# Altium schematic sheet Sitara_IO_Bank_123.SchDoc
size A3; SheetNumber: 7; SheetTotal: 10
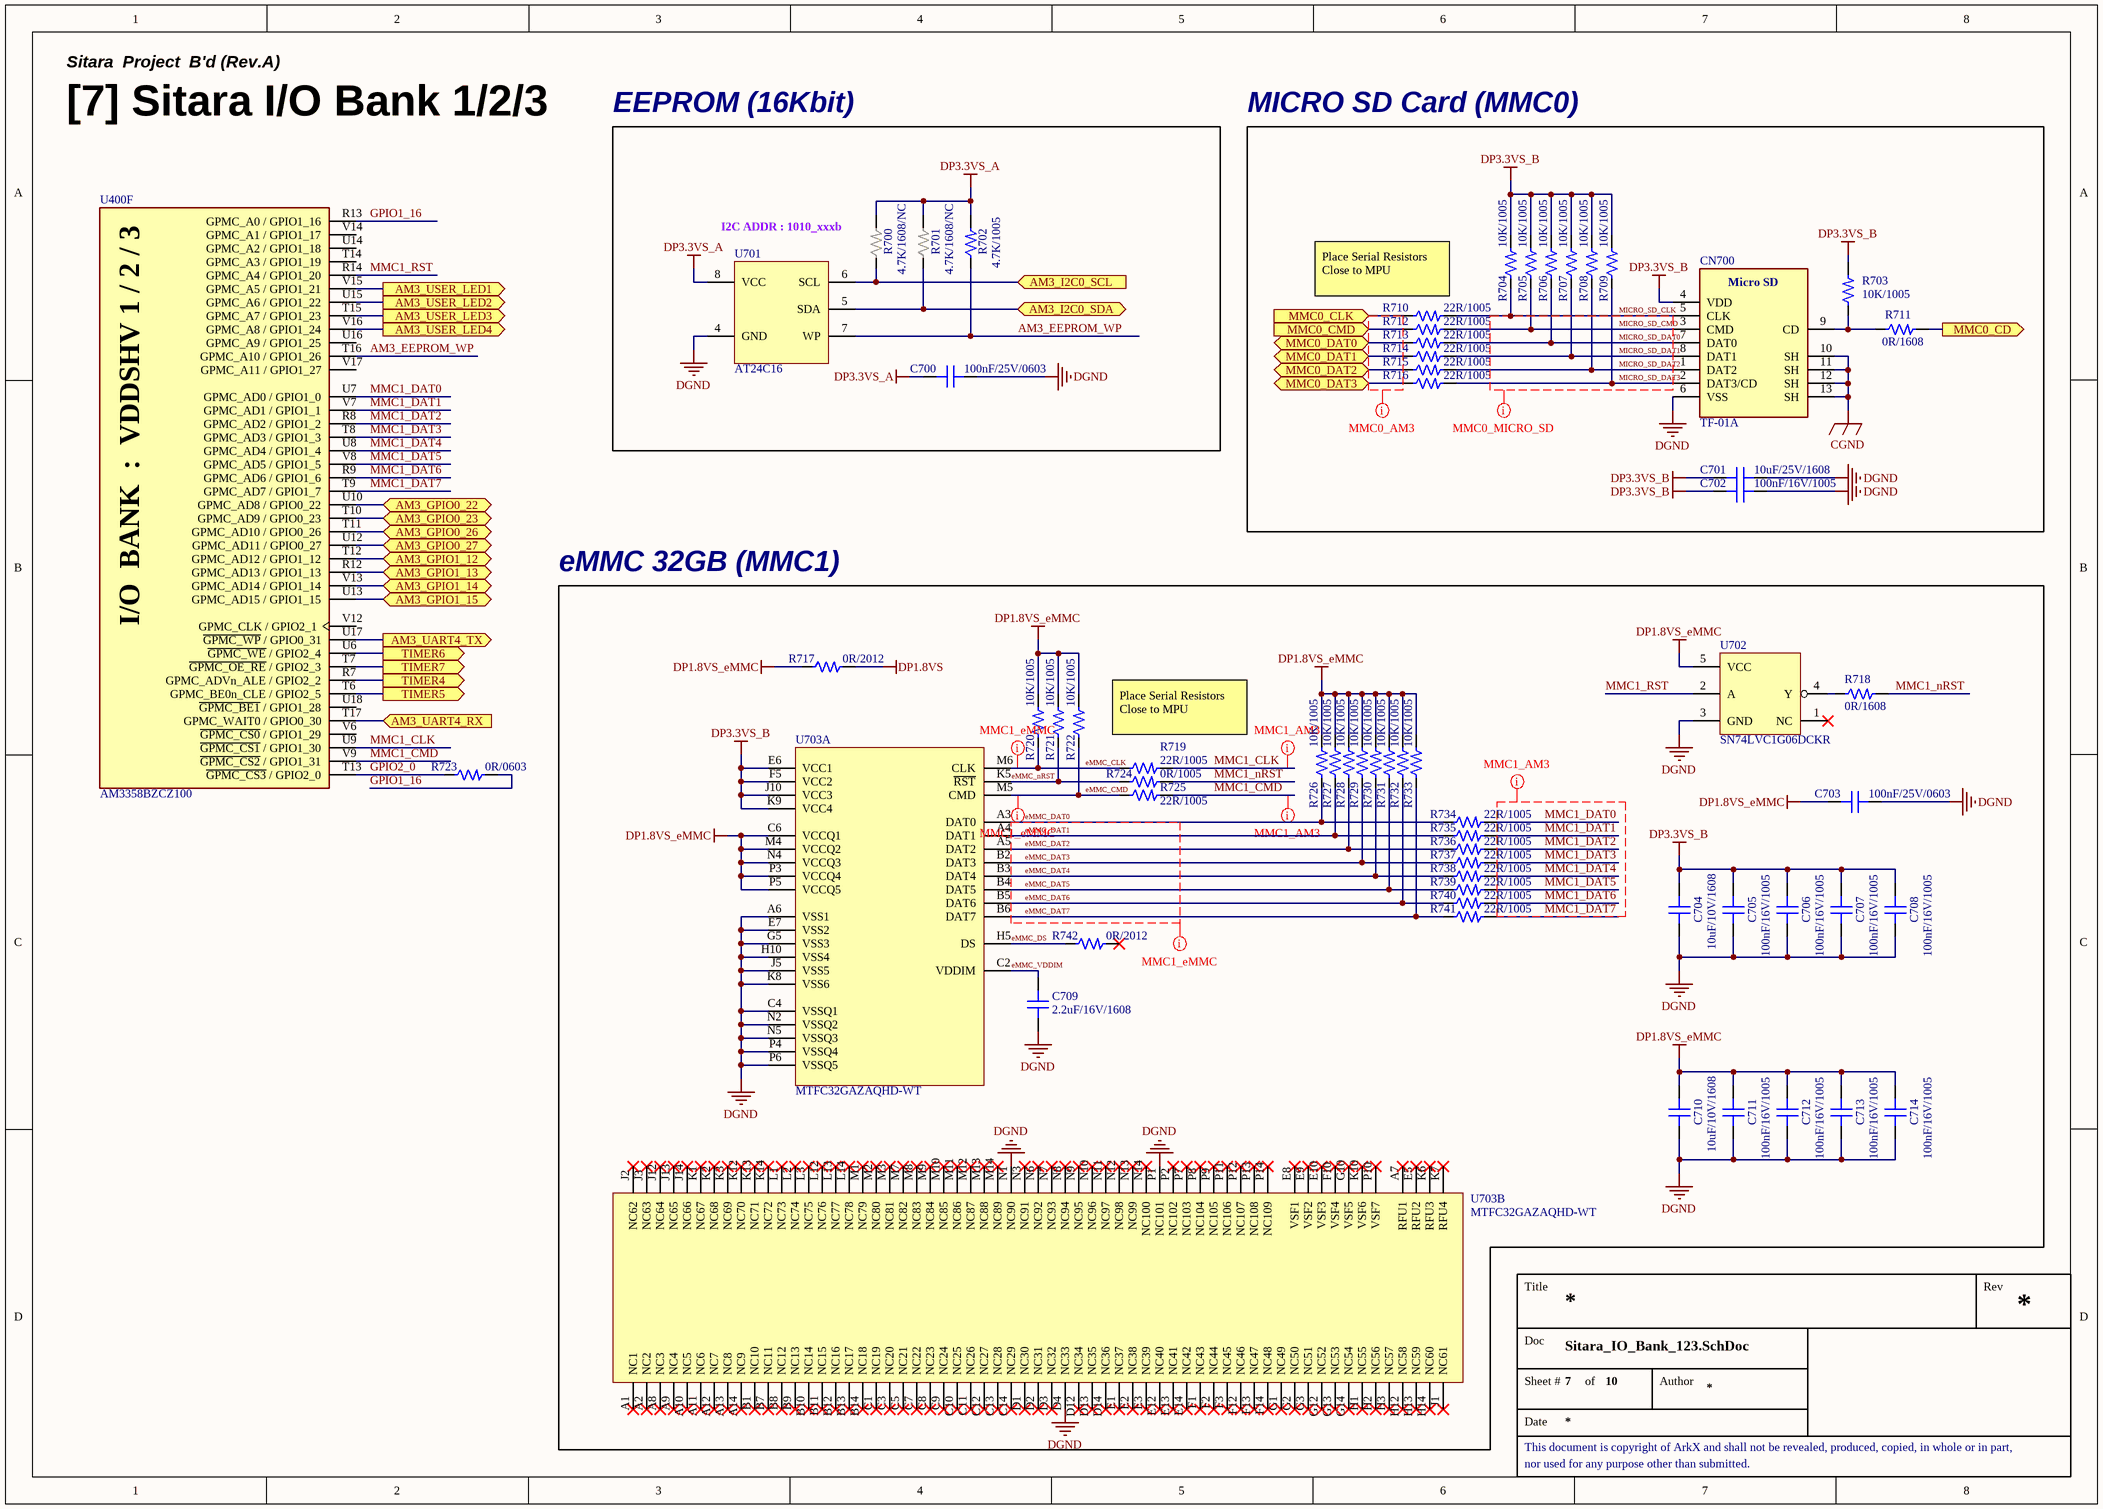
[diagram p0: Sitara_IO_Bank_123.SchDoc]

## Parts
C700  100nF/25V/0603  [CAP 0603 (0201_INCH)]
C701  10uF/25V/1608  [CAP 1608 (0603_INCH)]
C702  100nF/16V/1005  [CAP 1005 (0402_INCH)]
C703  100nF/25V/0603  [CAP 0603 (0201_INCH)]
C704  10uF/10V/1608  [CAP 1608 (0603_INCH)]
C705  100nF/16V/1005  [CAP 1005 (0402_INCH)]
C706  100nF/16V/1005  [CAP 1005 (0402_INCH)]
C707  100nF/16V/1005  [CAP 1005 (0402_INCH)]
C708  100nF/16V/1005  [CAP 1005 (0402_INCH)]
C709  2.2uF/16V/1608  [CAP 1608 (0603_INCH)]
C710  10uF/10V/1608  [CAP 1608 (0603_INCH)]
C711  100nF/16V/1005  [CAP 1005 (0402_INCH)]
C712  100nF/16V/1005  [CAP 1005 (0402_INCH)]
C713  100nF/16V/1005  [CAP 1005 (0402_INCH)]
C714  100nF/16V/1005  [CAP 1005 (0402_INCH)]
CN700  TF-01A  [CON_MICRO-SD_Socket_TF-01A]
R700  4.7K/1608/NC  [RES 1608 (0603_inch)/NC]
R701  4.7K/1608/NC  [RES 1608 (0603_inch)/NC]
R702  4.7K/1005  [RES 1005 (0402_inch)]
R703  10K/1005  [RES 1005 (0402_inch)]
R704  10K/1005  [RES 1005 (0402_inch)]
R705  10K/1005  [RES 1005 (0402_inch)]
R706  10K/1005  [RES 1005 (0402_inch)]
R707  10K/1005  [RES 1005 (0402_inch)]
R708  10K/1005  [RES 1005 (0402_inch)]
R709  10K/1005  [RES 1005 (0402_inch)]
R710  22R/1005  [RES 1005 (0402_inch)]
R711  0R/1608  [RES 1608 (0603_inch)]
R712  22R/1005  [RES 1005 (0402_inch)]
R713  22R/1005  [RES 1005 (0402_inch)]
R714  22R/1005  [RES 1005 (0402_inch)]
R715  22R/1005  [RES 1005 (0402_inch)]
R716  22R/1005  [RES 1005 (0402_inch)]
R717  0R/2012  [RES 2012 (0805_inch)]
R718  0R/1608  [RES 1608 (0603_inch)]
R719  22R/1005  [RES 1005 (0402_inch)]
R720  10K/1005  [RES 1005 (0402_inch)]
R721  10K/1005  [RES 1005 (0402_inch)]
R722  10K/1005  [RES 1005 (0402_inch)]
R723  0R/0603  [RES 0603 (0201_inch)]
R724  0R/1005  [RES 1005 (0402_inch)]
R725  22R/1005  [RES 1005 (0402_inch)]
R726  10K/1005  [RES 1005 (0402_inch)]
R727  10K/1005  [RES 1005 (0402_inch)]
R728  10K/1005  [RES 1005 (0402_inch)]
R729  10K/1005  [RES 1005 (0402_inch)]
R730  10K/1005  [RES 1005 (0402_inch)]
R731  10K/1005  [RES 1005 (0402_inch)]
R732  10K/1005  [RES 1005 (0402_inch)]
R733  10K/1005  [RES 1005 (0402_inch)]
R734  22R/1005  [RES 1005 (0402_inch)]
R735  22R/1005  [RES 1005 (0402_inch)]
R736  22R/1005  [RES 1005 (0402_inch)]
R737  22R/1005  [RES 1005 (0402_inch)]
R738  22R/1005  [RES 1005 (0402_inch)]
R739  22R/1005  [RES 1005 (0402_inch)]
R740  22R/1005  [RES 1005 (0402_inch)]
R741  22R/1005  [RES 1005 (0402_inch)]
R742  0R/2012  [RES 2012 (0805_inch)]
U400  AM3358BZCZ100  [IC_SOC_AM3358BZCZ100]  (part F of 8)
U701  AT24C16  [TSSOP-8_PW (TI)]
U702  SN74LVC1G06DCKR  [IC_SC-70-5]
U703  MTFC32GAZAQHD-WT  [IC_VFBGA-153]  (parts A,B of 2)

## Blocks framed on the sheet
EEPROM (16Kbit): C700 R700-R702 U701
MICRO SD Card (MMC0): C701 C702 CN700 R703-R716
eMMC 32GB (MMC1): C703-C714 R717-R722 R724-R742 U702 U703

## Ports
AM3_GPIO0_22 (bidir, see Sitara_Connectors[1B]), AM3_GPIO0_23 (bidir, see Sitara_Connectors[1C]), AM3_GPIO0_26 (bidir, see Sitara_Connectors[1C]), AM3_GPIO0_27 (bidir, see Sitara_Connectors[1C]), AM3_GPIO1_12 (bidir, see Sitara_Connectors[1C]), AM3_GPIO1_13 (bidir, see Sitara_Connectors[1C]), AM3_GPIO1_14 (bidir, see Sitara_Connectors[1C]), AM3_GPIO1_15 (bidir, see Sitara_Connectors[1C]), AM3_I2C0_SCL (in, see Power[3C], Sitara_IO_Bank_6[2B]), AM3_I2C0_SDA (bidir, see Power[3C], Sitara_IO_Bank_6[2B]), AM3_UART4_RX (in, see Sitara_Connectors[2C]), AM3_UART4_TX (out, see Sitara_Connectors[2C]), AM3_USER_LED1 (out, see Sitara_AUX[4C], Sitara_Connectors[3C]), AM3_USER_LED2 (out, see Sitara_AUX[4D], Sitara_Connectors[3C]), AM3_USER_LED3 (out, see Sitara_AUX[4D], Sitara_Connectors[3C]), AM3_USER_LED4 (out, see Sitara_AUX[4D], Sitara_Connectors[3C]), MMC0_CD (out, see Sitara_IO_Bank_6[2B]), MMC0_CLK (in, see Sitara_IO_Bank_45[2A]), MMC0_CMD (in, see Sitara_IO_Bank_45[2A]), MMC0_DAT0 (bidir, see Sitara_IO_Bank_45[2A]), MMC0_DAT1 (bidir, see Sitara_IO_Bank_45[2A]), MMC0_DAT2 (bidir, see Sitara_IO_Bank_45[2A]), MMC0_DAT3 (bidir, see Sitara_IO_Bank_45[2A]), TIMER4 (out, see Sitara_Connectors[4B]), TIMER5 (out, see Sitara_Connectors[4B]), TIMER6 (out, see Sitara_Connectors[4B]), TIMER7 (out, see Sitara_Connectors[4B])

## Nets
CGND: CN700.10(SH) CN700.11(SH) CN700.12(SH) CN700.13(SH)
DGND: C700.2 C701.2 C702.2 C703.2 C704.1 C705.1 C706.1 C707.1 C708.1 C709.1 C710.1 C711.1 C712.1 C713.1 C714.1 CN700.6(VSS) U701.4(GND) U702.3(GND) U703.A6(VSS1) U703.C4(VSSQ1) U703.D4(NC33) U703.E7(VSS2) U703.G5(VSS3) U703.H10(VSS4) U703.J5(VSS5) U703.K8(VSS6) U703.N1(NC90) U703.N2(VSSQ2) U703.N5(VSSQ3) U703.P1(NC101) U703.P4(VSSQ4) U703.P6(VSSQ5)
DP1.8VS: R717.2
DP1.8VS_eMMC: C703.1 C710.2 C711.2 C712.2 C713.2 C714.2 R717.1 R720.2 R721.2 R722.2 R726.2 R727.2 R728.2 R729.2 R730.2 R731.2 R732.2 R733.2 U702.5(VCC) U703.C6(VCCQ1) U703.M4(VCCQ2) U703.N4(VCCQ3) U703.P3(VCCQ4) U703.P5(VCCQ5)
DP3.3VS_A: C700.1 R700.2 R701.2 R702.2 U701.8(VCC)
DP3.3VS_B: C701.1 C702.1 C704.2 C705.2 C706.2 C707.2 C708.2 CN700.4(VDD) R703.2 R704.2 R705.2 R706.2 R707.2 R708.2 R709.2 U703.E6(VCC1) U703.F5(VCC2) U703.J10(VCC3) U703.K9(VCC4)
AM3_EEPROM_WP: R702.1 U400.T16(GPMC_A10_/_GPIO1_26) U701.7(WP)
AM3_GPIO0_22: U400.U10(GPMC_AD8_/_GPIO0_22) ; port AM3_GPIO0_22
AM3_GPIO0_23: U400.T10(GPMC_AD9_/_GPIO0_23) ; port AM3_GPIO0_23
AM3_GPIO0_26: U400.T11(GPMC_AD10_/_GPIO0_26) ; port AM3_GPIO0_26
AM3_GPIO0_27: U400.U12(GPMC_AD11_/_GPIO0_27) ; port AM3_GPIO0_27
AM3_GPIO1_12: U400.T12(GPMC_AD12_/_GPIO1_12) ; port AM3_GPIO1_12
AM3_GPIO1_13: U400.R12(GPMC_AD13_/_GPIO1_13) ; port AM3_GPIO1_13
AM3_GPIO1_14: U400.V13(GPMC_AD14_/_GPIO1_14) ; port AM3_GPIO1_14
AM3_GPIO1_15: U400.U13(GPMC_AD15_/_GPIO1_15) ; port AM3_GPIO1_15
AM3_I2C0_SCL: R700.1 U701.6(SCL) ; port AM3_I2C0_SCL
AM3_I2C0_SDA: R701.1 U701.5(SDA) ; port AM3_I2C0_SDA
AM3_UART4_RX: U400.T17(GPMC_WAIT0_/_GPIO0_30) ; port AM3_UART4_RX
AM3_UART4_TX: U400.U17(~{GPMC_WP}_/_GPIO0_31) ; port AM3_UART4_TX
AM3_USER_LED1: U400.V15(GPMC_A5_/_GPIO1_21) ; port AM3_USER_LED1
AM3_USER_LED2: U400.U15(GPMC_A6_/_GPIO1_22) ; port AM3_USER_LED2
AM3_USER_LED3: U400.T15(GPMC_A7_/_GPIO1_23) ; port AM3_USER_LED3
AM3_USER_LED4: U400.V16(GPMC_A8_/_GPIO1_24) ; port AM3_USER_LED4
eMMC_CLK: R719.1 R720.1 U703.M6(CLK)
eMMC_CMD: R722.1 R725.1 U703.M5(CMD)
eMMC_DAT0: R726.1 R734.1 U703.A3(DAT0)
eMMC_DAT1: R727.1 R735.1 U703.A4(DAT1)
eMMC_DAT2: R728.1 R736.1 U703.A5(DAT2)
eMMC_DAT3: R729.1 R737.1 U703.B2(DAT3)
eMMC_DAT4: R730.1 R738.1 U703.B3(DAT4)
eMMC_DAT5: R731.1 R739.1 U703.B4(DAT5)
eMMC_DAT6: R732.1 R740.1 U703.B5(DAT6)
eMMC_DAT7: R733.1 R741.1 U703.B6(DAT7)
eMMC_DS: R742.1 U703.H5(DS)
eMMC_nRST: R721.1 R724.1 U703.K5(~{RST})
eMMC_VDDIM: C709.2 U703.C2(VDDIM)
GPIO1_16: R723.2 U400.R13(GPMC_A0_/_GPIO1_16)
GPIO2_0: R723.1 U400.T13(~{GPMC_CS3}_/_GPIO2_0)
MICRO_SD_CLK: CN700.5(CLK) R704.1 R710.2
MICRO_SD_CMD: CN700.3(CMD) R705.1 R712.2
MICRO_SD_DAT0: CN700.7(DAT0) R706.1 R713.2
MICRO_SD_DAT1: CN700.8(DAT1) R707.1 R714.2
MICRO_SD_DAT2: CN700.1(DAT2) R708.1 R715.2
MICRO_SD_DAT3: CN700.2(DAT3/CD) R709.1 R716.2
MMC0_CD: R711.2 ; port MMC0_CD
MMC0_CLK: R710.1 ; port MMC0_CLK
MMC0_CMD: R712.1 ; port MMC0_CMD
MMC0_DAT0: R713.1 ; port MMC0_DAT0
MMC0_DAT1: R714.1 ; port MMC0_DAT1
MMC0_DAT2: R715.1 ; port MMC0_DAT2
MMC0_DAT3: R716.1 ; port MMC0_DAT3
MMC1_CLK: R719.2 U400.U9(~{GPMC_CS1}_/_GPIO1_30)
MMC1_CMD: R725.2 U400.V9(~{GPMC_CS2}_/_GPIO1_31)
MMC1_DAT0: R734.2 U400.U7(GPMC_AD0_/_GPIO1_0)
MMC1_DAT1: R735.2 U400.V7(GPMC_AD1_/_GPIO1_1)
MMC1_DAT2: R736.2 U400.R8(GPMC_AD2_/_GPIO1_2)
MMC1_DAT3: R737.2 U400.T8(GPMC_AD3_/_GPIO1_3)
MMC1_DAT4: R738.2 U400.U8(GPMC_AD4_/_GPIO1_4)
MMC1_DAT5: R739.2 U400.V8(GPMC_AD5_/_GPIO1_5)
MMC1_DAT6: R740.2 U400.R9(GPMC_AD6_/_GPIO1_6)
MMC1_DAT7: R741.2 U400.T9(GPMC_AD7_/_GPIO1_7)
MMC1_nRST: R718.2 R724.2
MMC1_RST: U400.R14(GPMC_A4_/_GPIO1_20) U702.2(A)
TIMER4: U400.R7(GPMC_ADVn_ALE_/_GPIO2_2) ; port TIMER4
TIMER5: U400.T6(GPMC_BE0n_CLE_/_GPIO2_5) ; port TIMER5
TIMER6: U400.U6(~{GPMC_WE}_/_GPIO2_4) ; port TIMER6
TIMER7: U400.T7(~{GPMC_OE_RE}_/_GPIO2_3) ; port TIMER7
NetCN700_9: CN700.9(CD) R703.1 R711.1
NetR718_1: R718.1 U702.4(Y)

Not connected (* = marked no-connect by the designer): R742 2*; U400 T14(GPMC_A3_/_GPIO1_19) U14(GPMC_A2_/_GPIO1_18) U16(GPMC_A9_/_GPIO1_25) U18(~{GPMC_BE1}_/_GPIO1_28) V6(~{GPMC_CS0}_/_GPIO1_29) V12(GPMC_CLK_/_GPIO2_1) V14(GPMC_A1_/_GPIO1_17) V17(GPMC_A11_/_GPIO1_27); U702 1(NC)*; U703 A1(NC1)* A2(NC2)* A7(RFU1)* A8(NC3)* A9(NC4)* A10(NC5)* A11(NC6)* A12(NC7)* A13(NC8)* A14(NC9)* B1(NC10)* B7(NC11)* B8(NC12)* B9(NC13)* B10(NC14)* B11(NC15)* B12(NC16)* B13(NC17)* B14(NC18)* C1(NC19)* C3(NC20)* C5(NC21)* C7(NC22)* C8(NC23)* C9(NC24)* C10(NC25)* C11(NC26)* C12(NC27)* C13(NC28)* C14(NC29)* D1(NC30)* D2(NC31)* D3(NC32)* D12(NC34)* D13(NC35)* D14(NC36)* E1(NC37)* E2(NC38)* E3(NC39)* E5(RFU2)* E8(VSF1)* E9(VSF2)* E10(VSF3)* E12(NC40)* E13(NC41)* E14(NC42)* F1(NC43)* F2(NC44)* F3(NC45)* F10(VSF4)* F12(NC46)* F13(NC47)* F14(NC48)* G1(NC49)* G2(NC50)* G3(NC51)* G10(VSF5)* G12(NC52)* G13(NC53)* G14(NC54)* H1(NC55)* H2(NC56)* H3(NC57)* H12(NC58)* H13(NC59)* H14(NC60)* J1(NC61)* J2(NC62)* J3(NC63)* J12(NC64)* J13(NC65)* J14(NC66)* K1(NC67)* K2(NC68)* K3(NC69)* K6(RFU3)* K7(RFU4)* K10(VSF6)* K12(NC70)* K13(NC71)* K14(NC72)* L1(NC73)* L2(NC74)* L3(NC75)* L12(NC76)* L13(NC77)* L14(NC78)* M1(NC79)* M2(NC80)* M3(NC81)* M7(NC82)* M8(NC83)* M9(NC84)* M10(NC85)* M11(NC86)* M12(NC87)* M13(NC88)* M14(NC89)* N3(NC91)* N6(NC92)* N7(NC93)* N8(NC94)* N9(NC95)* N10(NC96)* N11(NC97)* N12(NC98)* N13(NC99)* N14(NC100)* P2(NC102)* P7(NC103)* P8(NC104)* P9(NC105)* P10(VSF7)* P11(NC106)* P12(NC107)* P13(NC108)* P14(NC109)*

## Layout directives
rule Matched Net Lengths [Delay Tolerance = 10ps]; net class MMC0_MICRO_SD: MICRO_SD_CLK, MICRO_SD_CMD, MICRO_SD_DAT0, MICRO_SD_DAT1, MICRO_SD_DAT2, MICRO_SD_DAT3
rule Matched Net Lengths [Delay Tolerance = 10ps]; net class MMC1_AM3: MMC1_CLK, MMC1_CMD, MMC1_DAT0, MMC1_DAT1, MMC1_DAT2, MMC1_DAT3, MMC1_DAT4, MMC1_DAT5, MMC1_DAT6, MMC1_DAT7
rule Matched Net Lengths [Delay Tolerance = 10ps]; net class MMC1_eMMC: eMMC_CLK, eMMC_CMD, eMMC_DAT0, eMMC_DAT1, eMMC_DAT2, eMMC_DAT3, eMMC_DAT4, eMMC_DAT5, eMMC_DAT6, eMMC_DAT7
rule Matched Net Lengths [Delay Tolerance = 10ps]; net class MMC0_AM3: (no net found under the mark)

## Notes on the sheet
- Sitara  Project  B'd (Rev.A)
- [7] Sitara I/O Bank 1/2/3
- I2C ADDR : 1010_xxxb
- Place Serial Resistors Close to MPU
- Title
- Rev
- Doc
- Sheet #
- of
- Author
- This document is copyright of ArkX and shall not be revealed, produced, copied, in whole or in part,
- Date
- nor used for any purpose other than submitted.
- (in symbol CON_MICRO-SD_Socket_TF-01A) Micro SD
- (in symbol IC_SOC_AM3358BZCZ100, part F) I/O  BANK  :  VDDSHV 1 / 2 / 3

## Library data of the parts
C700 C703 = CAP_100nF/25V/0603: Ceramic CAP_100nF/25V/0603; JLCPCB Part Type: Extended Part; LCSC Part #: C181047
C701 = CAP_10uF/25V/1608: Ceramic CAP_10uF/25V/1608; LCSC Part #: C96446; JLCPCB Part Type: Basic Part
C702 C705-C708 C711-C714 = CAP_100nF/16V/1005: Ceramic CAP_100nF/16V/1005; LCSC Part #: C1525; JLCPCB Part Type: Basic Part
C704 C710 = CAP_10uF/10V/1608: Ceramic CAP_10uF/10V/1608; LCSC Part #: C19702; JLCPCB Part Type: Basic Part
C709 = CAP_2.2uF/16V/1608: Ceramic CAP_2.2uF/16V/1608; LCSC Part #: C23630; JLCPCB Part Type: Basic Part
CN700 = CON_MICRO-SD_Socket_TF-01A: Card Slot MicroSD card (TF card) Self-bouncing SMD SD Card / Memory Card Connector ROHS; LCSC Part #: C91145; JLCPCB Part Type: Extended Part
R700 R701 = RES_NC_4.7K/1608/0.1W: RES_4.7K/1608/0.1W; Value: 4.7K; Power Rating: 0.1W; Precision: 1%; Size: 1608
R702 = RES_4.7K/1005/62.5mW: Value: 4.7K; Power Rating: 62.5mW; Precision: 1%; Size: 1005; LCSC Part #: C25900; JLCPCB Part Type: Basic Part
R703-R709 R720-R722 R726-R733 = RES_10K/1005/62.5mW: Value: 10K; Power Rating: 62.5mW; Precision: 1%; Size: 1005; LCSC Part #: C25744; JLCPCB Part Type: Basic Part
R710 R712-R716 R719 R725 R734-R741 = RES_22R/1005/62.5mW: Value: 22R; Power Rating: 62.5mW; Precision: 1%; Size: 1005; LCSC Part #: C25092; JLCPCB Part Type: Basic Part
R711 R718 = RES_0R/1608/0.1W: Value: 0R; Power Rating: 0.1W; Precision: 1%; Size: 1608; LCSC Part #: C21189; JLCPCB Part Type: Basic Part
R717 R742 = RES_0R/2012/0.125W: Value: 0R; Power Rating: 0.125W; Precision: 1%; Size: 2012; LCSC Part #: C17477; JLCPCB Part Type: Basic Part
R723 = RES_0R/0603/50mW: 50mW Thick Film Resistors 25V ±1% 0Ω 0201  Chip Resistor - Surface Mount ROHS; Value: 0R; Size: 0603; Power Rating: 50mW; Precision: 1%; LCSC Part #: C106227; JLCPCB Part Type: Extended Part
R724 = RES_0R/1005/62.5mW: Value: 0R; Power Rating: 62.5mW; Precision: 1%; Size: 1005; LCSC Part #: C17168; JLCPCB Part Type: Basic Part
U400 = IC_SOC_AM3358BZCZ100: ARM® Cortex®-A8 Microprocessor IC Sitara™ 1 Core, 32-Bit 1.0GHz 324-NFBGA (15x15); LCSC Part #: C73932; JLCPCB Part Type: Extended Part
U701 = IC_EEPROM_AT24C16: IC EEPROM 16KBIT I2C 1MHZ 8TSSOP; LCSC Part #: C112954; JLCPCB Part Type: Extended Part
U702 = IC_BUF_SN74LVC1G06DCKR: Inverter IC 1 Channel Open Drain SC-70-5; LCSC Part #: C7828; JLCPCB Part Type: Extended Part
U703 = IC_eMMC_MTFC32GAZAQHD-WT: FLASH - NAND Memory IC 256Gbit MMC 200 MHz 153-VFBGA (11.5x13); LCSC Part #: C5330430; JLCPCB Part Type: Extended Part